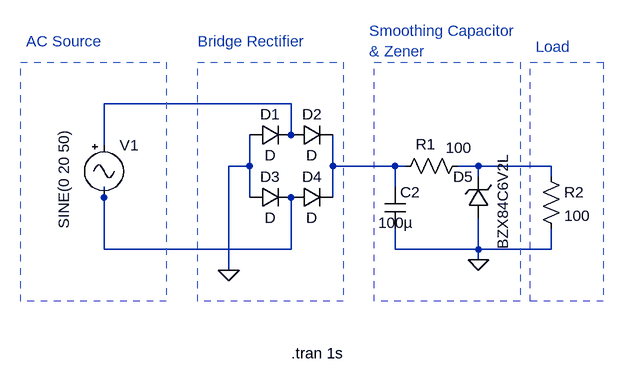
[diagram p0: schematic pcb_project.asc]
pcb_project.asc, the LTspice schematic file:
Version 4
SHEET 1 880 680
WIRE 176 80 -112 80
WIRE 176 128 176 80
WIRE -112 144 -112 80
WIRE 112 176 112 128
WIRE 112 176 80 176
WIRE 240 176 240 128
WIRE 336 176 240 176
WIRE 352 176 336 176
WIRE 464 176 432 176
WIRE 576 176 464 176
WIRE 464 192 464 176
WIRE 576 192 576 176
WIRE 336 208 336 176
WIRE -112 224 -112 208
WIRE 112 224 112 176
WIRE 240 224 240 176
WIRE -112 304 -112 224
WIRE 176 304 176 224
WIRE 176 304 -112 304
WIRE 336 304 336 272
WIRE 464 304 464 256
WIRE 464 304 336 304
WIRE 576 304 576 272
WIRE 576 304 464 304
WIRE 464 320 464 304
WIRE 80 336 80 176
FLAG 464 320 0
FLAG 80 336 0
SYMBOL diode 112 144 R270
WINDOW 0 32 32 VTop 2
WINDOW 3 0 32 VBottom 2
SYMATTR InstName D1
SYMBOL diode 176 144 R270
WINDOW 0 32 32 VTop 2
WINDOW 3 0 32 VBottom 2
SYMATTR InstName D2
SYMBOL diode 112 240 R270
WINDOW 0 32 32 VTop 2
WINDOW 3 0 32 VBottom 2
SYMATTR InstName D3
SYMBOL diode 176 240 R270
WINDOW 0 32 32 VTop 2
WINDOW 3 0 32 VBottom 2
SYMATTR InstName D4
SYMBOL Misc\\signal -112 128 R0
WINDOW 123 0 0 Left 0
WINDOW 39 0 0 Left 0
WINDOW 3 -62 -8 VRight 2
SYMATTR InstName V1
SYMATTR Value SINE(0 20 50)
SYMBOL cap 320 208 R0
WINDOW 3 -10 55 Left 2
SYMATTR Value 100µ
SYMATTR InstName C2
SYMATTR SpiceLine V=25
SYMBOL zener 480 256 R180
WINDOW 0 24 64 Left 2
WINDOW 3 -22 -48 VRight 2
SYMATTR InstName D5
SYMATTR Value BZX84C6V2L
SYMBOL res 448 160 R90
WINDOW 0 -2 65 VBottom 2
WINDOW 3 -28 14 VTop 2
SYMATTR InstName R1
SYMATTR Value 100
SYMBOL res 560 176 R0
SYMATTR InstName R2
SYMATTR Value 100
TEXT 176 464 Left 2 !.tran 1s
TEXT -232 -16 Left 2 ;AC Source
TEXT 32 -16 Left 2 ;Bridge Rectifier
TEXT 296 -32 Left 2 ;Smoothing Capacitor \n& Zener
TEXT 552 -8 Left 2 ;Load
RECTANGLE Normal -16 384 -240 16 2
RECTANGLE Normal 256 384 32 16 2
RECTANGLE Normal 528 384 304 16 2
RECTANGLE Normal 656 384 544 16 2

The netlist it stands for:
* pcb_project.asc
D1 0 N001 D
D2 N001 N002 D
D3 0 N004 D
D4 N004 N002 D
V1 N001 N004 SINE(0 20 50)
C2 N002 0 100µ V=25
D5 0 N003 BZX84C6V2L
R1 N003 N002 100
R2 N003 0 100
.model D D
.lib standard.dio
.tran 1s
* AC Source
* Bridge Rectifier
* Smoothing Capacitor
* & Zener
* Load
.backanno
.end